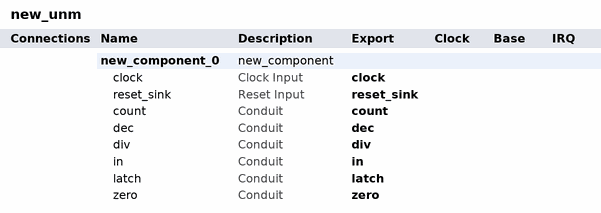
[diagram p0: system contents]
# Platform Designer (Qsys) system new_unm, Cyclone V 5CGXFC7C7F23C8
# Parameters at their usual value, and those the tool derives, are not listed.
package require qsys
create_system new_unm
set_project_property DEVICE_FAMILY {Cyclone V}
set_project_property DEVICE 5CGXFC7C7F23C8

add_instance new_component_0 new_component 1.0
set_instance_property new_component_0 AUTO_EXPORT true

# exported interfaces
add_interface clock clock sink
set_interface_property clock EXPORT_OF new_component_0.clock
add_interface count conduit end
set_interface_property count EXPORT_OF new_component_0.count
add_interface dec conduit end
set_interface_property dec EXPORT_OF new_component_0.dec
add_interface div conduit end
set_interface_property div EXPORT_OF new_component_0.div
add_interface in conduit end
set_interface_property in EXPORT_OF new_component_0.in
add_interface latch conduit end
set_interface_property latch EXPORT_OF new_component_0.latch
add_interface reset_sink reset sink
set_interface_property reset_sink EXPORT_OF new_component_0.reset_sink
add_interface zero conduit end
set_interface_property zero EXPORT_OF new_component_0.zero

set_interconnect_requirement {$system} qsys_mm.clockCrossingAdapter HANDSHAKE
set_interconnect_requirement {$system} qsys_mm.enableEccProtection FALSE
set_interconnect_requirement {$system} qsys_mm.insertDefaultSlave FALSE
set_interconnect_requirement {$system} qsys_mm.maxAdditionalLatency 1

save_system new_unm.qsys
